# EAGLE design arduino_board_1iter (EAGLE 9.6.2)
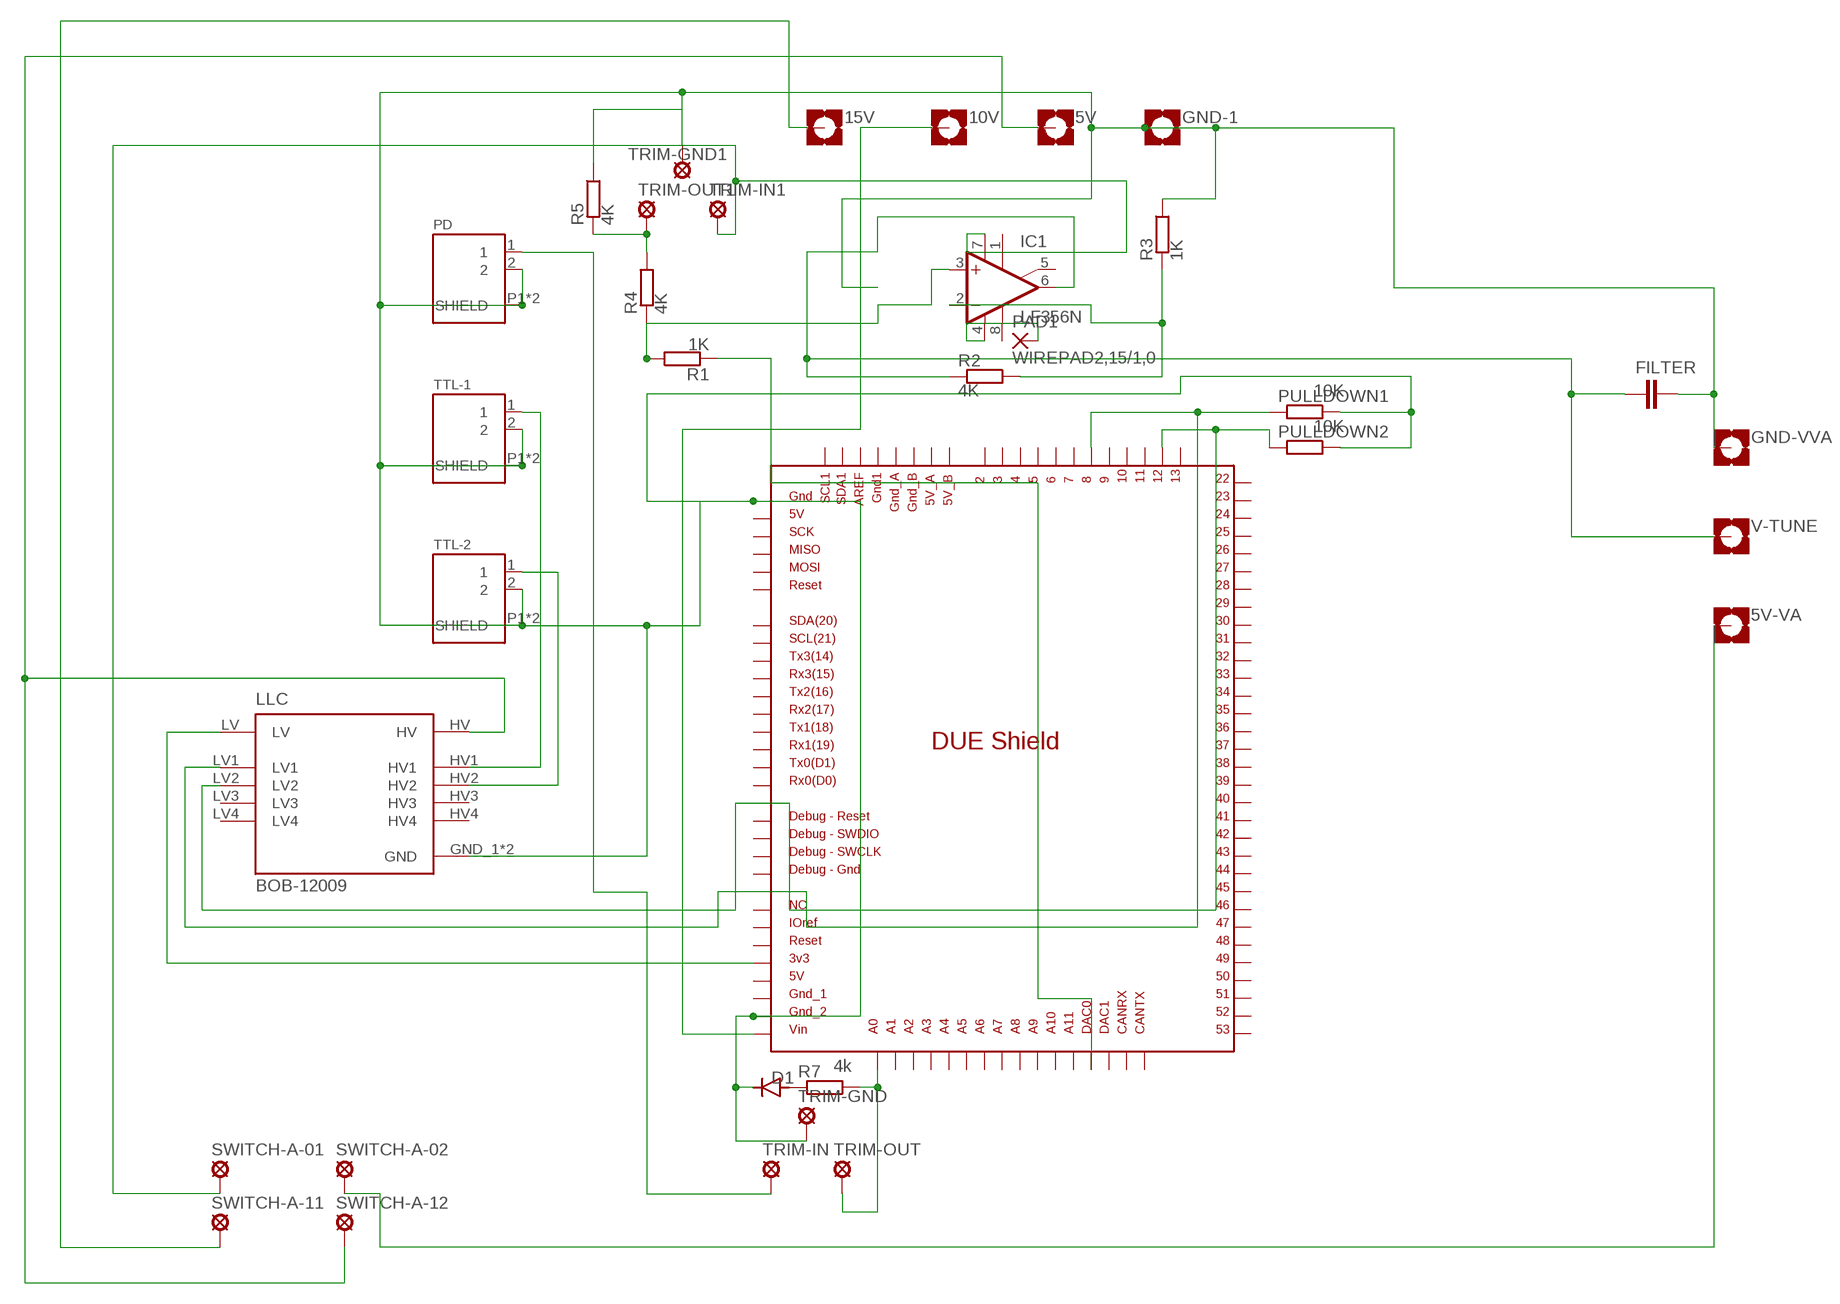
[diagram p0: schematic, sheet 1]

## Parts
5V  MOUNT-PAD-SQUARE2.8  [2,8-PAD-SQUARE]
5V-VA  MOUNT-PAD-SQUARE2.8  [2,8-PAD-SQUARE]
10V  MOUNT-PAD-SQUARE2.8  [2,8-PAD-SQUARE]
15V  MOUNT-PAD-SQUARE2.8  [2,8-PAD-SQUARE]
D1  BA243A  [DO35-10]
FILTER  C-EUC1812K  [C1812K]
GND-1  MOUNT-PAD-SQUARE2.8  [2,8-PAD-SQUARE]
GND-VVA  MOUNT-PAD-SQUARE2.8  [2,8-PAD-SQUARE]
IC1  LF356N  [DIL08]
LLC  BOB-12009  [CONV_BOB-12009]
PAD1  WIREPAD2,15/1,0  [2,15/1,0]
PD  1-1337543-0  [CONN_1-1337543-0]
PULLDOWN1  10K  SMS-0  [SMS-0]
PULLDOWN2  10K  SMS-0  [SMS-0]
R1  1K  SMS-0  [SMS-0]
R2  4K  SMS-0  [SMS-0]
R3  1K  SMS-0  [SMS-0]
R4  4K  SMS-0  [SMS-0]
R5  4K  SMS-0  [SMS-0]
R7  4k  SMS-0  [SMS-0]
SWITCH-A-01  LSP10  [LSP10]
SWITCH-A-02  LSP10  [LSP10]
SWITCH-A-11  LSP10  [LSP10]
SWITCH-A-12  LSP10  [LSP10]
TRIM-GND  LSP10  [LSP10]
TRIM-GND1  LSP10  [LSP10]
TRIM-IN  LSP10  [LSP10]
TRIM-IN1  LSP10  [LSP10]
TRIM-OUT  LSP10  [LSP10]
TRIM-OUT1  LSP10  [LSP10]
TTL-1  1-1337543-0  [CONN_1-1337543-0]
TTL-2  1-1337543-0  [CONN_1-1337543-0]
U$1  DUE(NORMAL)  [DUE(NORMAL)]
V-TUNE  MOUNT-PAD-SQUARE2.8  [2,8-PAD-SQUARE]

## Nets
GND: D1.C FILTER.2 GND-1.B2,8(MOUNT) GND-VVA.B2,8(MOUNT) LLC.GND_1(GND) LLC.GND_2(GND) PD.2 PD.P1(SHIELD) PD.P2(SHIELD) PULLDOWN1.1 PULLDOWN2.1 R3.1 R5.1 TRIM-GND1.MP TRIM-GND.MP TTL-1.2 TTL-1.P1(SHIELD) TTL-1.P2(SHIELD) TTL-2.2 TTL-2.P1(SHIELD) TTL-2.P2(SHIELD) U$1.5V_ICSP U$1.GND_2
N$1: R1.2 U$1.DAC0
N$2: IC1.7(V+) SWITCH-A-01.MP TRIM-IN1.MP
N$3: IC1.3(+IN) R1.1 R4.2
N$4: FILTER.1 IC1.6(OUT) R2.2 V-TUNE.B2,8(MOUNT)
N$5: IC1.2(-IN) R2.1 R3.2
N$6: 10V.B2,8(MOUNT) U$1.VIN
N$9: 5V.B2,8(MOUNT) LLC.HV SWITCH-A-12.MP
N$10: LLC.LV U$1.3V3
N$11: LLC.LV1 PULLDOWN1.2 U$1.8
N$12: LLC.HV1 TTL-1.1
N$13: LLC.HV2 TTL-2.1
N$14: PD.1 TRIM-IN.MP
N$15: 5V-VA.B2,8(MOUNT) SWITCH-A-02.MP
N$16: LLC.LV2 PULLDOWN2.2 U$1.12
N$17: R7.1 TRIM-OUT.MP U$1.A0
N$18: D1.A R7.2
N$19: 15V.B2,8(MOUNT) SWITCH-A-11.MP
N$20: R4.1 R5.2 TRIM-OUT1.MP
N$21: IC1.4(V-) PAD1.1(P)
Unconnected: IC1.1(ON1) IC1.5(ON2) IC1.8(OPT) LLC.HV3 LLC.HV4 LLC.LV3 LLC.LV4 U$1.2 U$1.3 U$1.4 U$1.5 U$1.5V U$1.5V_A U$1.5V_B U$1.6 U$1.7 U$1.9 U$1.10 U$1.11 U$1.13 U$1.22 U$1.23 U$1.24 U$1.25 U$1.26 U$1.27 U$1.28 U$1.29 U$1.30 U$1.31 U$1.32 U$1.33 U$1.34 U$1.35 U$1.36 U$1.37 U$1.38 U$1.39 U$1.40 U$1.41 U$1.42 U$1.43 U$1.44 U$1.45 U$1.46 U$1.47 U$1.48 U$1.49 U$1.50 U$1.51 U$1.52 U$1.53 U$1.A1 U$1.A2 U$1.A3 U$1.A4 U$1.A5 U$1.A6 U$1.A7 U$1.A8 U$1.A9 U$1.A10 U$1.A11 U$1.AREF U$1.CANRX U$1.CANTX U$1.DAC1 U$1.GND1 U$1.GND_1 U$1.GND_A U$1.GND_B U$1.GND_DEBUG U$1.GND_ICSP U$1.IOREF U$1.MISO_ICSP U$1.MOSI_ICSP U$1.NC U$1.RESET U$1.RESET_DEBUG U$1.RESET_ICSP U$1.RX0 U$1.RX1 U$1.RX2 U$1.RX3 U$1.SCK_ICSP U$1.SCL U$1.SCL1 U$1.SDA U$1.SDA1 U$1.SWCLK_DEBUG U$1.SWDIO_DEBUG U$1.TX0 U$1.TX1 U$1.TX2 U$1.TX3

## Library data of the parts
5V 5V-VA 10V 15V GND-1 GND-VVA V-TUNE = holes:MOUNT-PAD-SQUARE: MOUNTING PAD, square
D1 = diode:BA243A: DIODE
FILTER = rcl:C-EU: CAPACITOR, European symbol; SPICEPREFIX: C
IC1 = linear:LF356: OP AMP
LLC = BOB-12009:BOB-12009: Logic Level Converter - Bi-Direc Check prices <https://pricing.snapeda.com/parts/BOB-12009/SparkFun/view-part?ref=eda>; AVAILABILITY: In Stock; DESCRIPTION: BSS138 Logic-Level Translator Interface Evaluation Board; MF: SparkFun; MP: BOB-12009; PACKAGE: None; PRICE: None; PURCHASE-URL: https://pricing.snapeda.com/search/part/BOB-12009/?ref=eda
PAD1 = wirepad:WIREPAD: Wire PAD connect wire on PCB
PD TTL-1 TTL-2 = jayich_lab_eagle_library:1-1337543-0: BNC appliance socket, right angle [TE Connectivity] 1-1337543-0 BNC appliance socket, right angle; COMMENT: 1-1337543-0; DESCRIPTION: BNC Ins R/A PCB Skt 50Ohm White; DIGI-KEY_PART_NUMBER: A97553-ND; DIGI-KEY_PURCHASE_URL: https://www.digikey.com/product-detail/en/te-connectivity-amp-connectors/1-1337543-0/A97553-ND/1755940?utm_source=snapeda&utm_medium=aggregator&utm_campaign=symbol; MF: TE Connectivity; MP: 1-1337543-0; NUMBER_OF_POSITIONS: 1; PACKAGE: None; TE_PURCHASE_URL: https://www.te.com/usa-en/product-1-1337543-0.html?te_bu=Cor&te_type=disp&te_campaign=seda_glo_cor-seda-global-disp-prtnr-fy19-seda-model-bom-cta_sma-317_1&elqCampaignId=32493
PULLDOWN1 PULLDOWN2 R1-R5 R7 = resistor-shunt:SMS-0: SMD SHUNT RESISTOR; OC_FARNELL: unknown; OC_NEWARK: unknown
SWITCH-A-01 SWITCH-A-02 SWITCH-A-11 SWITCH-A-12 TRIM-GND TRIM-GND1 TRIM-IN TRIM-IN1 TRIM-OUT TRIM-OUT1 = solpad:LSP10: SOLDER PAD drill 1.0 mm, distributor Buerklin, 12H555
U$1 = DUElib130425:DUE(NORMAL)

## Board
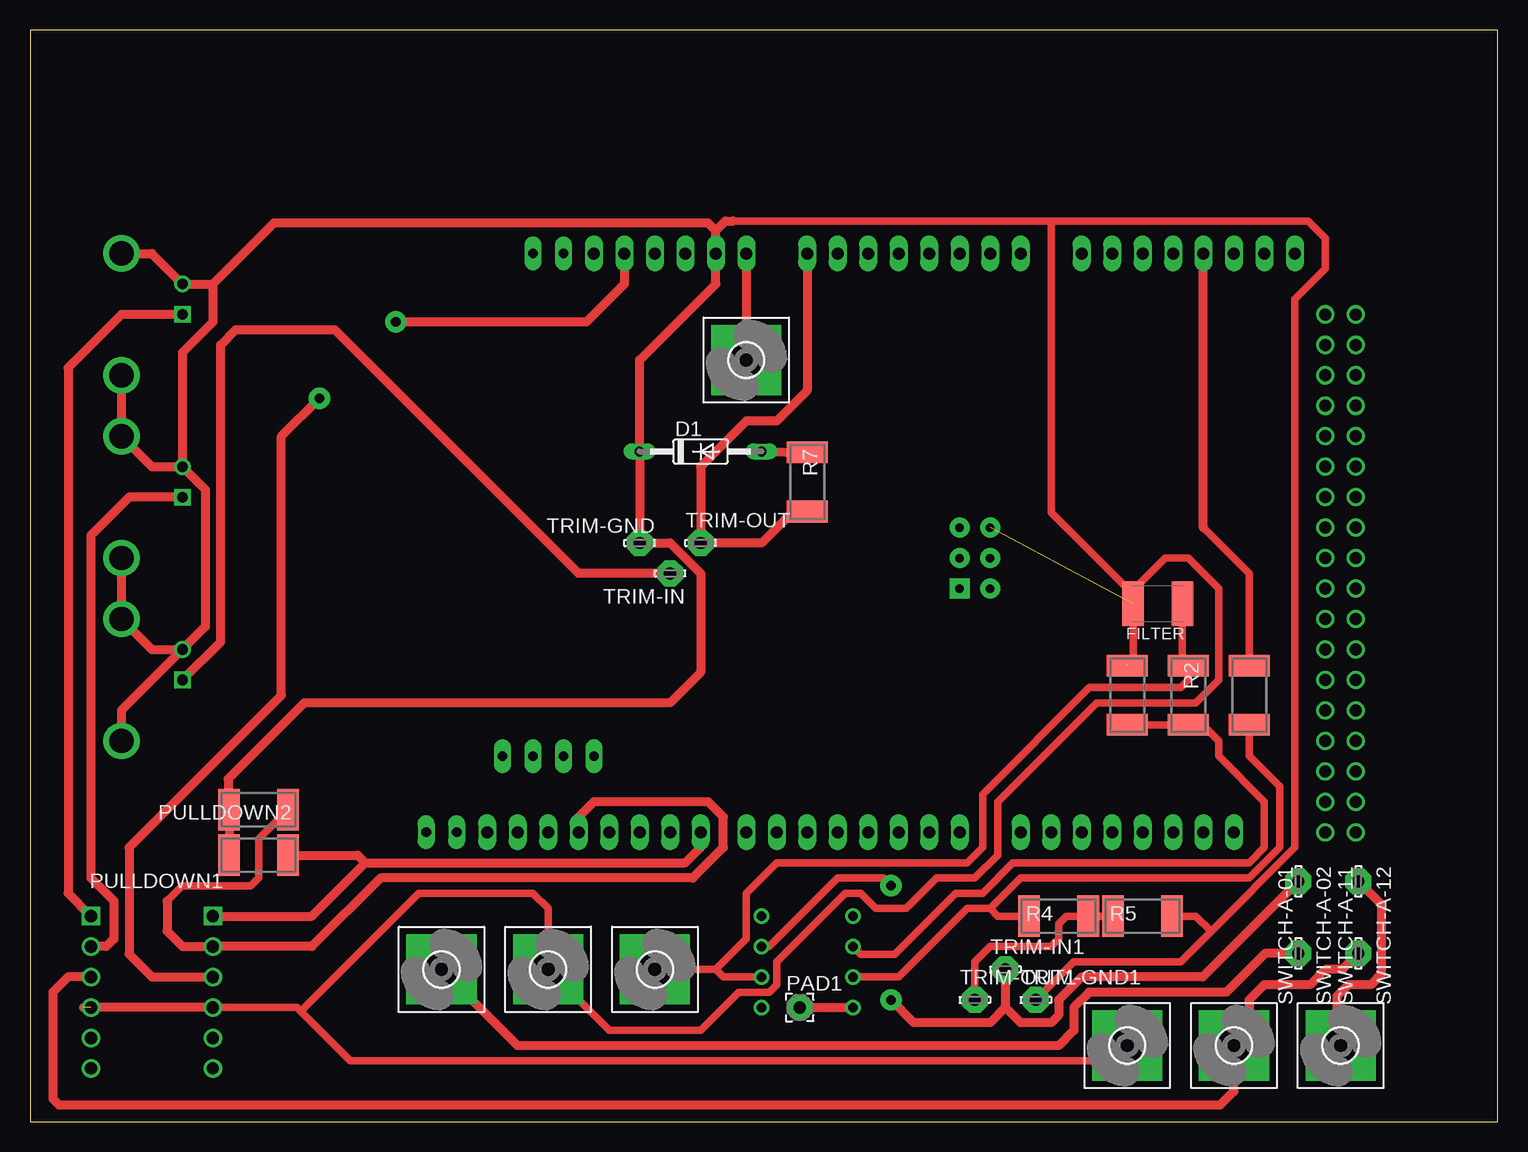
[diagram p1: board, top side]
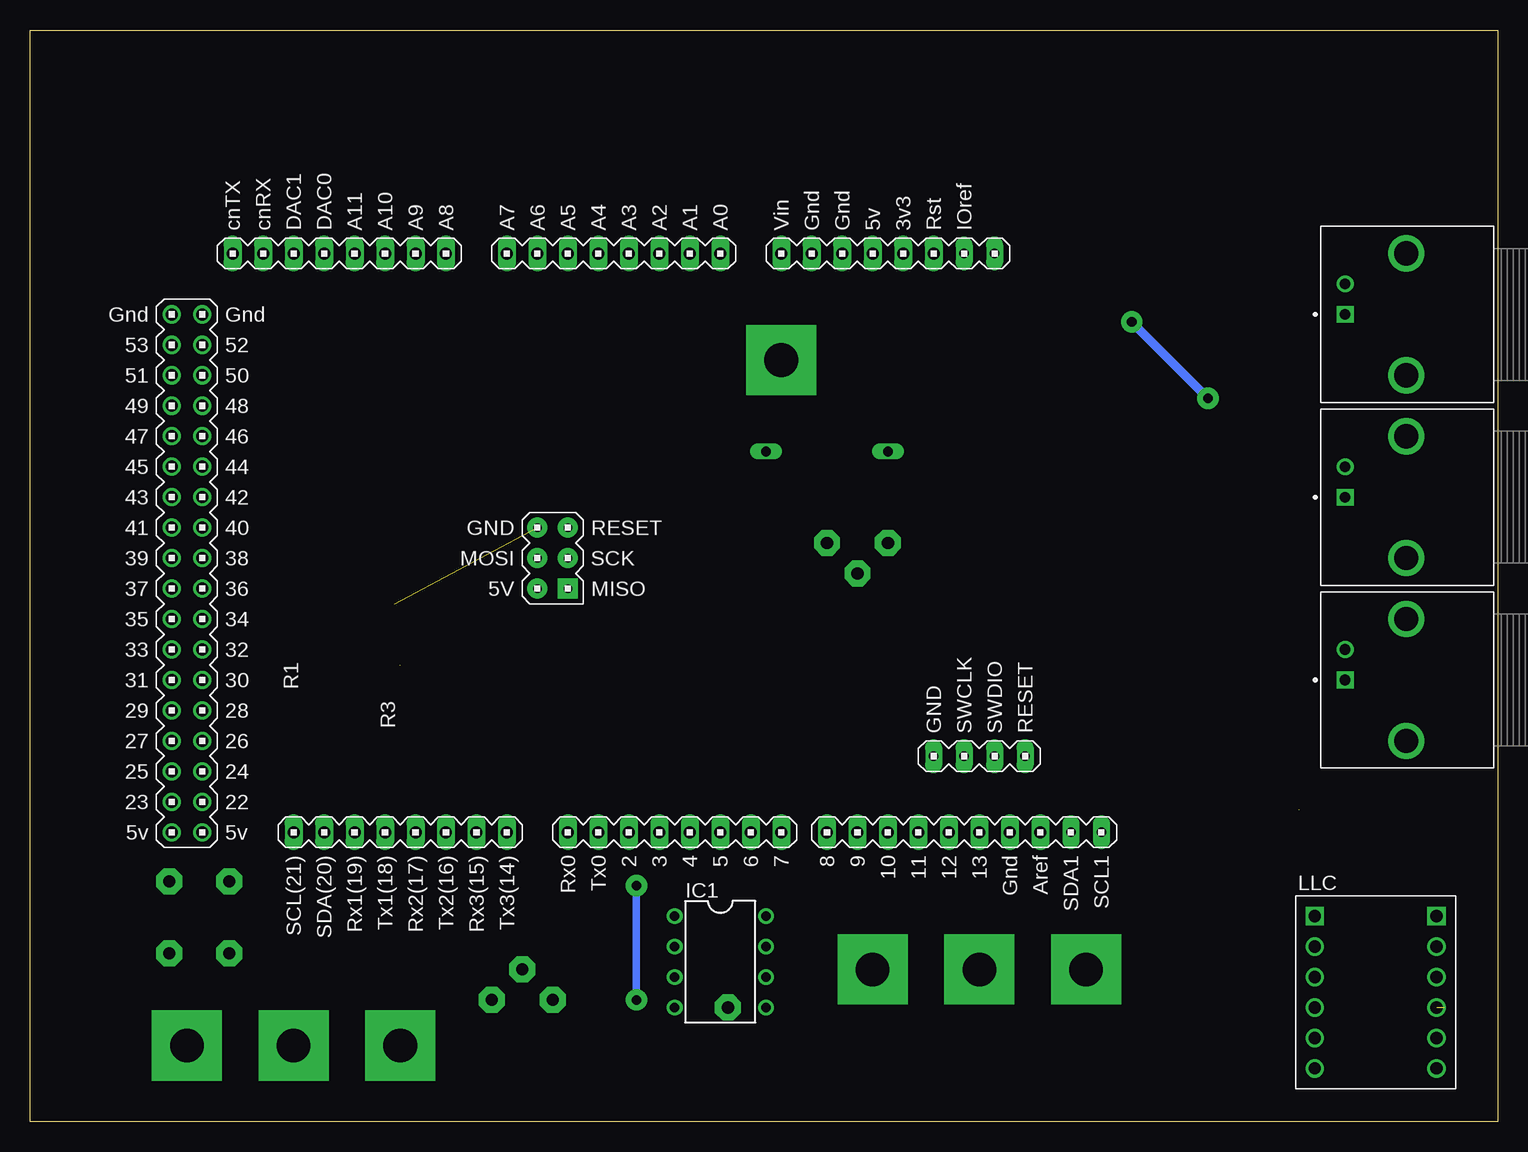
[diagram p2: board, bottom side, seen from below]

Size 122.3 x 91.02 mm. Coordinates in mm from the lower left corner, seen from the top.
Outline: 0,0 122.3,0 122.3,91.02 0,91.02 0,0
Copper layers (1*16): Top 0.035mm / dielectric 1.5mm / Bottom 0.035mm
Design rules "default": minimum track width 6mil, minimum drill 0.35mm, track to track 6mil, track to pad 6mil, pad to pad 6mil, via to via 6mil, smd to smd 6mil, copper to edge 40mil, drill to drill 6mil, minimum pad ring 10mil, minimum via ring 8mil, stop-mask expansion 4mil, vias tented up to drill 0mil, thermal gap 10mil

### Footprints (pad centres in the part's own frame; a part is rotated, then mirrored left to right if it is on the bottom)
2,8-PAD-SQUARE = drill 2.8 pad 5.842 square: B2,8 0,0
DO35-10 = drill 0.813 long: A 5.08,0; C -5.08,0
C1812K = smd 1.8 x 3.7: 1 -2.05,0; 2 2.05,0
DIL08 = drill 0.813 pad 1.27: 1 -3.81,-3.81; 2 -1.27,-3.81; 3 1.27,-3.81; 4 3.81,-3.81; 5 3.81,3.81; 6 1.27,3.81; 7 -1.27,3.81; 8 -3.81,3.81
CONV_BOB-12009 = drill 1.016: GND_1 5.08,-1.27; GND_2 -5.08,-1.27; HV 5.08,1.27; HV2 5.08,3.81; HV3 5.08,-3.81; HV4 5.08,-6.35; LV -5.08,1.27; LV2 -5.08,3.81; LV3 -5.08,-3.81; LV4 -5.08,-6.35 | drill 1.016 square: HV1 5.08,6.35; LV1 -5.08,6.35
2,15/1,0 = drill 1.016 pad 2.159 octagon: 1 0,0
CONN_1-1337543-0 = drill 0.89 square: 1 0,0 | drill 0.89: 2 0,-2.54 | drill 2.01: P1 -5.08,-5.08; P2 -5.08,5.08
SMS-0 = smd 1.8 x 3.45: 1 2.464,0; 2 -2.464,0
LSP10 = drill 1.016 pad 2.159 octagon: MP 0,0
DUE(NORMAL) = drill 1 long: 2 -16.51,30.48; 3 -19.05,30.48; 3V3 -39.37,-17.78; 4 -21.59,30.48; 5 -24.13,30.48; 5V -36.83,-17.78; 6 -26.67,30.48; 7 -29.21,30.48; 8 -33.02,30.48; 9 -35.56,30.48; 10 -38.1,30.48; 11 -40.64,30.48; 12 -43.18,30.48; 13 -45.72,30.48; A0 -24.13,-17.78; A1 -21.59,-17.78; A2 -19.05,-17.78; A3 -16.51,-17.78; A4 -13.97,-17.78; A5 -11.43,-17.78; A6 -8.89,-17.78; A7 -6.35,-17.78; A8 -1.27,-17.78; A9 1.27,-17.78; A10 3.81,-17.78; A11 6.35,-17.78; AREF -50.8,30.48; AREF1 -50.8,30.48; CANRX 13.97,-17.78; CANTX 16.51,-17.78; DAC0 8.89,-17.78; DAC1 11.43,-17.78; GND1 -48.26,30.48; GND_1 -34.29,-17.78; GND_2 -31.75,-17.78; RESET -41.91,-17.78; RX0 -11.43,30.48; RX1 6.35,30.48; RX2 1.27,30.48; RX3 -3.81,30.48; SCL 11.43,30.48; SDA 8.89,30.48; TX0 -13.97,30.48; TX1 3.81,30.48; TX2 -1.27,30.48; TX3 -6.35,30.48; VIN -29.21,-17.78 | drill 1: 5V_A 19.05,30.48; 5V_B 21.59,30.48; 22 19.05,27.94; 23 21.59,27.94; 24 19.05,25.4; 25 21.59,25.4; 26 19.05,22.86; 27 21.59,22.86; 28 19.05,20.32; 29 21.59,20.32; 30 19.05,17.78; 31 21.59,17.78; 32 19.05,15.24; 33 21.59,15.24; 34 19.05,12.7; 35 21.59,12.7; 36 19.05,10.16; 37 21.59,10.16; 38 19.05,7.62; 39 21.59,7.62; 40 19.05,5.08; 41 21.59,5.08; 42 19.05,2.54; 43 21.59,2.54; 44 19.05,0; 45 21.59,0; 46 19.05,-2.54; 47 21.59,-2.54; 48 19.05,-5.08; 49 21.59,-5.08; 50 19.05,-7.62; 51 21.59,-7.62; 52 19.05,-10.16; 53 21.59,-10.16; GND_A 19.05,-12.7; GND_B 21.59,-12.7 | drill 0.7 pad 1.676: 5V_ICSP -8.89,5.08; GND_ICSP -8.89,10.16; MOSI_ICSP -8.89,7.62; RESET_ICSP -11.43,5.08; SCK_ICSP -11.43,7.62 | drill 0.8 pad 1.422 long: GND_DEBUG -41.91,24.13; IOREF -44.45,-17.78; NC -46.99,-17.78; RESET_DEBUG -49.53,24.13; SCL1 -55.88,30.48; SDA1 -53.34,30.48; SWCLK_DEBUG -44.45,24.13; SWDIO_DEBUG -46.99,24.13 | drill 0.7 pad 1.676 square: MISO_ICSP -11.43,10.16

### Placement (x,y rotation side)
5V  100.33,6.35 0 top
5V-VA  34.29,12.7 0 top
10V  59.69,63.5 0 top
15V  109.22,6.35 0 top
D1  55.88,55.88 0 top
FILTER  93.98,43.18 180 top
GND-1  91.44,6.35 0 top
GND-VVA  43.18,12.7 0 top
IC1  64.77,13.33 270 bottom
LLC  10.16,10.79 0 bottom
PAD1  64.14,9.53 0 top
PD  12.7,36.83 180 bottom
PULLDOWN1  19.05,22.22 180 top
PULLDOWN2  19.05,26.04 180 top
R1  101.6,35.56 270 top
R2  96.52,35.56 270 top
R3  91.44,35.56 90 top
R4  85.72,17.14 0 top
R5  92.71,17.14 0 top
R7  64.77,53.34 270 top
SWITCH-A-01  105.69,20.04 270 top
SWITCH-A-02  105.69,14.04 270 top
SWITCH-A-11  110.69,20.04 270 top
SWITCH-A-12  110.69,14.04 270 top
TRIM-GND  50.8,48.26 180 top
TRIM-GND1  83.82,10.16 0 top
TRIM-IN  53.34,45.72 180 top
TRIM-IN1  81.28,12.7 0 top
TRIM-OUT  55.88,48.26 180 top
TRIM-OUT1  78.74,10.16 0 top
TTL-1  12.7,67.31 180 bottom
TTL-2  12.7,52.07 180 bottom
U$1  88.9,54.61 180 bottom
V-TUNE  52.07,12.7 0 top

### Tracks (layer width: path | path; a pad name or v marks a point on that pad's centre or on a via)
GND  (4 unrouted)
  Top 0.152: 7.62,57.79 TTL-2.P1 | 6.99,31.75 PD.P2
  Top 0.61: 91.93,38.51 R3.1 | TRIM-GND1.MP 87,13.33 95.89,13.33 98.42,15.88 | 98.42,15.88 105.41,22.86 105.41,68.58 107.95,71.12 107.95,73.66 106.52,75.09 85.09,75.09 | 58.58,75.09 85.09,75.09 | LLC.GND_2 22.23,9.53 22.54,9.21 | 22.54,9.21 26.67,5.08 90.17,5.08 GND-1.B2,8 | 22.54,9.21 32.38,19.05 41.91,19.05 43.18,17.78 GND-VVA.B2,8 48.26,7.62 55.88,7.62 59.05,10.79 61.59,10.79 62.23,11.43 62.23,13.33 67.94,19.05 69.22,19.05 70.48,17.78 73.03,17.78 75.56,20.32 78.74,20.32 80.64,22.22 80.64,26.67 88.9,34.93 97.16,34.93 99.06,36.83 99.06,44.45 96.52,46.99 94.61,46.99 92.08,44.45 92.08,43.82 | 91.44,38.1 91.93,38.59 FILTER.2 92.08,43.33 92.08,43.82 | 85.09,75.09 85.09,50.8 92.08,43.82 | R5.1 97.16,17.14 98.42,15.88
  Top 0.762: 15.24,69.85 TTL-1.2 10.16,72.39 TTL-1.P1 | 15.24,69.85 20.32,74.93 56.52,74.93 57.15,74.3 | PULLDOWN2.1 PULLDOWN1.1 | LLC.GND_2 4.45,9.53 | TTL-2.2 12.7,64.14 15.24,66.67 15.24,69.85 | TTL-2.2 14.61,52.71 14.61,41.28 PD.2 | TTL-1.P2 7.62,57.79 | TTL-2.P1 10.16,54.61 TTL-2.2 | TTL-2.P2 PD.P1 10.16,39.37 PD.2 | PD.2 7.62,34.29 PD.P2 | 16.51,26.04 16.51,28.57 22.86,34.93 53.34,34.93 55.88,37.47 55.88,45.72 53.34,48.26 TRIM-GND.MP D1.C 50.8,63.5 57.15,69.85 U$1.GND_2 57.15,74.3 | 58.58,75.09 57.95,75.09 57.15,74.3
N$1
  Top 0.61: 97.79,49.53 101.6,45.72 R1.2
  Top 0.762: 97.79,49.53 U$1.DAC0
N$2  (via drill 0.8 pad 1.78)
  Top 0.61: IC1.7 61.59,14.61 67.31,20.32 71.12,20.32 v71.75,19.68
  Top 0.762: 81.28,9.53 82.55,8.26 85.09,8.26 85.72,8.89 85.72,10.16 87.63,12.06 97.72,12.06 SWITCH-A-01.MP | 81.28,9.53 80.01,8.26 73.66,8.26 v71.75,10.16 | TRIM-IN1.MP 81.28,9.53
  Bottom 0.61: v71.75,19.68 v71.75,10.16
N$3
  Top 0.61: R1.1 101.6,30.48 104.14,27.94 104.14,22.86 101.6,20.32 82.55,20.32 80.01,17.78 | 80.01,17.78 78.11,17.78 72.39,12.06 IC1.3 | 80.01,17.78 80.64,17.14 R4.2
N$4
  Top 0.61: 57.15,12.7 V-TUNE.B2,8 | FILTER.1 96.03,38.51 R2.2 96.52,36.83 95.89,36.2 88.27,36.2 79.38,27.3 79.38,22.86 78.11,21.59 62.23,21.59 59.69,19.05 59.69,15.24 57.15,12.7 | 57.15,12.7 57.78,12.06 IC1.6
N$5
  Top 0.61: 91.36,33.02 R3.2 R2.1 97.71,33.1 99.06,31.75 99.06,30.48 102.87,26.67 102.87,22.86 101.6,21.59 81.92,21.59 79.38,19.05 77.15,19.05 72.07,13.97 69.22,13.97 IC1.2
N$6
  Top 0.762: U$1.VIN 10V.B2,8
N$9
  Top 0.152: 100.65,3.49 100.65,6.67
  Top 0.61: 101.6,7.62 100.65,6.67 5V.B2,8
  Top 0.762: 101.6,7.62 101.6,10.16 102.87,11.43 106.68,11.43 107.95,12.7 109.36,12.7 SWITCH-A-12.MP | LLC.HV 3.17,12.06 1.91,10.79 1.91,1.91 2.41,1.4 99.19,1.4 100.33,2.54 5V.B2,8
N$10  (via drill 0.8 pad 1.78)
  Top 0.762: LLC.LV 10.16,12.06 8.26,13.97 8.26,22.86 20.95,35.56 20.95,57.15 v24.13,60.33 | U$1.3V3 49.53,69.85 46.35,66.67 v30.48,66.67
  Bottom 0.762: v24.13,60.33 v30.48,66.67
N$11
  Top 0.762: PULLDOWN1.2 27.3,22.22 27.94,21.59 | 27.94,21.59 54.61,21.59 55.88,22.86 U$1.8 | LLC.LV1 23.5,17.14 27.94,21.59
N$12
  Top 0.762: TTL-1.1 7.62,67.31 3.17,62.87 3.17,19.05 LLC.HV1
N$13
  Top 0.762: TTL-2.1 8.26,52.07 5.08,48.9 5.08,20.32 6.99,18.41 6.99,15.24 6.35,14.61 LLC.HV2
N$14
  Top 0.762: PD.1 15.88,40.01 15.88,64.77 17.14,66.04 25.4,66.04 45.72,45.72 TRIM-IN.MP
N$15
  Top 0.762: SWITCH-A-02.MP 102.94,14.04 99.69,10.79 88.27,10.79 87,9.53 87,7.62 85.72,6.35 40.64,6.35 5V-VA.B2,8
N$16
  Top 0.61: PULLDOWN2.2 19.05,23.57 19.05,20.32 18.41,19.68 12.7,19.68 11.43,18.41
  Top 0.762: U$1.12 45.72,25.4 46.99,26.67 56.52,26.67 57.78,25.4 57.78,22.86 55.24,20.32 29.21,20.32 23.5,14.61 LLC.LV2 12.7,14.61 11.43,15.88 11.43,18.41
N$17
  Top 0.762: U$1.A0 64.77,60.96 62.23,58.42 59.69,58.42 55.88,54.61 TRIM-OUT.MP 60.96,48.26 63.5,50.8 64.69,50.8 R7.1
N$18
  Top 0.762: D1.A R7.2
N$19
  Top 0.762: 15V.B2,8 108.9,6.67 108.9,10.48 109.86,11.43 111.76,11.43 112.64,12.31 112.64,18.09 SWITCH-A-11.MP
N$20
  Top 0.61: R5.2 R4.1 86.36,17.14 85.72,16.51 85.72,15.24 85.09,14.61 80.01,14.61 78.74,13.33 TRIM-OUT1.MP
N$21
  Top 0.762: PAD1.1 IC1.4